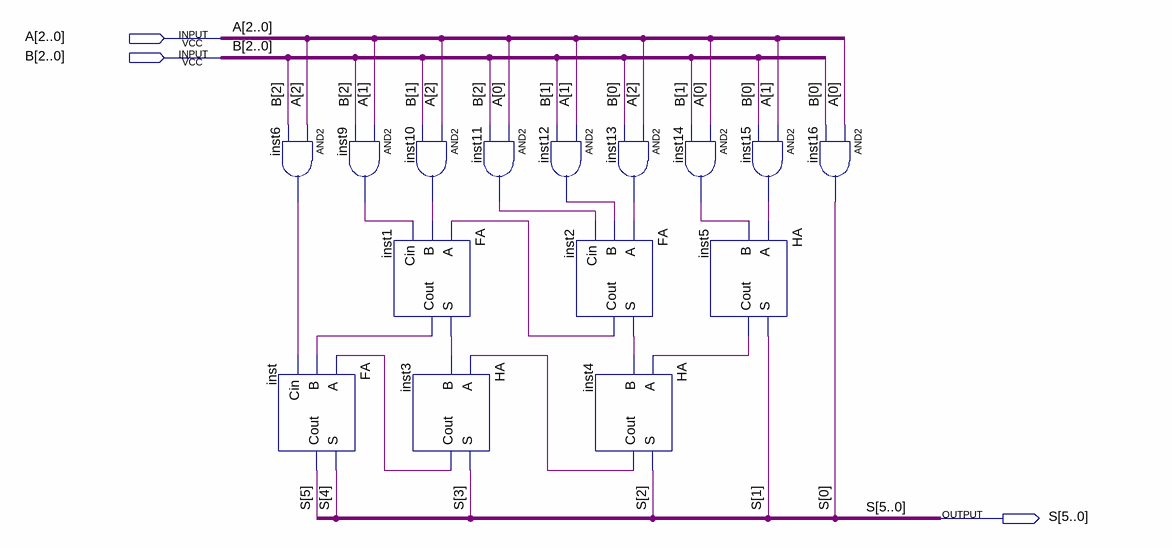
[diagram p0: schematic sheet]
// Quartus schematic NHAN3BIT.bdf as structural Verilog: 15 symbols, 3 pins
module NHAN3BIT (
  input  [2:0] A,
  input  [2:0] B,
  output [5:0] S
);

  wire inst1_cout, inst1_s, inst2_cout, inst2_s, inst3_cout, inst4_cout, inst5_cout, inst6_out, inst9_out,
       inst10_out, inst11_out, inst12_out, inst13_out, inst14_out, inst15_out;

  and inst6 (inst6_out, A[2], B[2]);
  FA inst (.A(inst3_cout), .B(inst1_cout), .Cin(inst6_out), .S(S[4]), .Cout(S[5]));
  and inst9 (inst9_out, A[1], B[2]);
  and inst10 (inst10_out, A[2], B[1]);
  FA inst1 (.A(inst2_cout), .B(inst10_out), .Cin(inst9_out), .S(inst1_s), .Cout(inst1_cout));
  HA inst3 (.A(inst4_cout), .B(inst1_s), .S(S[3]), .Cout(inst3_cout));
  and inst11 (inst11_out, A[0], B[2]);
  and inst12 (inst12_out, A[1], B[1]);
  FA inst2 (.A(inst13_out), .B(inst12_out), .Cin(inst11_out), .S(inst2_s), .Cout(inst2_cout));
  and inst13 (inst13_out, A[2], B[0]);
  HA inst4 (.A(inst5_cout), .B(inst2_s), .S(S[2]), .Cout(inst4_cout));
  and inst14 (inst14_out, A[0], B[1]);
  HA inst5 (.A(inst15_out), .B(inst14_out), .S(S[1]), .Cout(inst5_cout));
  and inst15 (inst15_out, A[1], B[0]);
  and inst16 (S[0], A[0], B[0]);
endmodule
